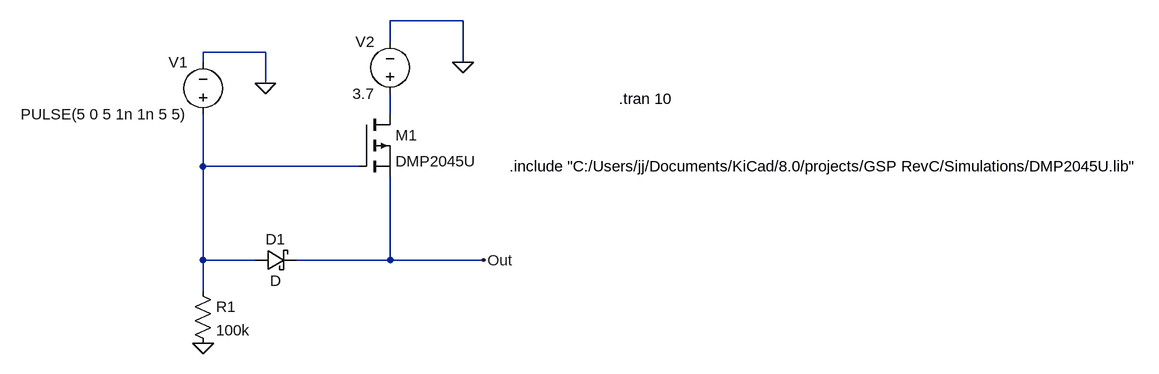
[diagram p0: schematic USB & Battery Switch.asc]
USB & Battery Switch.asc, the LTspice schematic file:
Version 4
SHEET 1 1536 680
WIRE 480 128 368 128
WIRE 368 160 368 128
WIRE 176 176 80 176
WIRE 80 192 80 176
WIRE 480 192 480 128
WIRE 176 224 176 176
WIRE 368 272 368 240
WIRE 80 352 80 272
WIRE 320 352 80 352
WIRE 80 496 80 352
WIRE 160 496 80 496
WIRE 368 496 368 368
WIRE 368 496 224 496
WIRE 512 496 368 496
WIRE 80 544 80 496
FLAG 80 624 0
FLAG 480 192 0
FLAG 176 224 0
FLAG 512 496 Out
SYMBOL pmos 320 272 R0
SYMATTR InstName M1
SYMATTR Value DMP2045U
SYMBOL schottky 160 512 R270
WINDOW 0 32 32 VTop 2
WINDOW 3 0 32 VBottom 2
SYMATTR InstName D1
SYMBOL Res 64 528 R0
SYMATTR InstName R1
SYMATTR Value 100k
SYMBOL voltage 80 288 R180
WINDOW 0 24 96 Left 2
WINDOW 3 24 16 Left 2
SYMATTR InstName V1
SYMATTR Value PULSE(5 0 5 1n 1n 5 5)
SYMBOL voltage 368 256 R180
WINDOW 0 24 96 Left 2
WINDOW 3 24 16 Left 2
SYMATTR InstName V2
SYMATTR Value 3.7
TEXT 720 248 Left 2 !.tran 10
TEXT 552 352 Left 2 !.include "C:/Users/jj/Documents/KiCad/8.0/projects/GSP RevC/Simulations/DMP2045U.lib"

The netlist it stands for:
* USB & Battery Switch.asc
M1 N001 N002 Out Out DMP2045U
D1 N002 Out D
R1 N002 0 100k
V1 N002 0 PULSE(5 0 5 1n 1n 5 5)
V2 N001 0 3.7
.model D D
.lib standard.dio
.model NMOS NMOS
.model PMOS PMOS
.lib standard.mos
.tran 10
.include "C:/Users/jj/Documents/KiCad/8.0/projects/GSP RevC/Simulations/DMP2045U.lib"
.backanno
.end